# EAGLE schematic circuit (EAGLE 7.5.0)
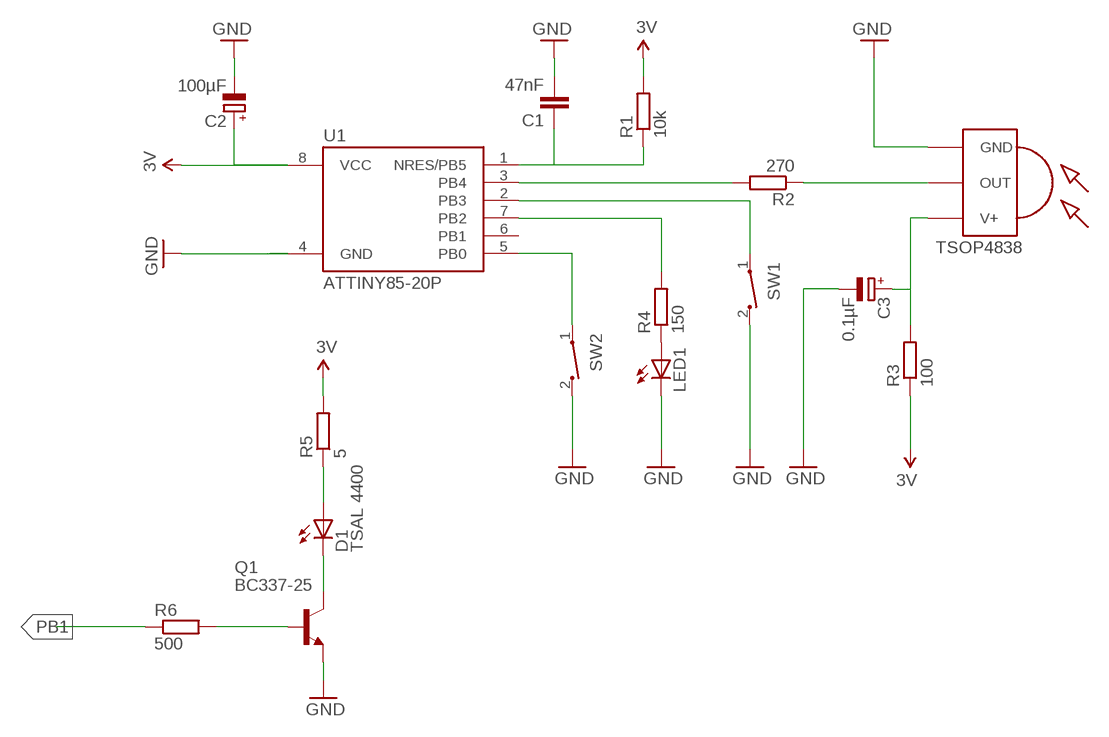
[diagram p0: schematic, sheet 1]

## Parts
C1  47nF  C-EU025-025X050  [C025-025X050]
C2  100µF  CPOL-EU085CS-1AR  [085CS_1AR]
C3  0.1µF  CPOL-EU085CS-1AR  [085CS_1AR]
D1  TSAL 4400  SFH482  [SFH482]
LED1  LED5MM  [LED5MM]
Q1  BC337-25  BC337  [TO92]
R1  10k  R-EU_0204/2V  [0204V]
R2  270  R-EU_0204/2V  [0204V]
R3  100  R-EU_0204/2V  [0204V]
R4  150  R-EU_0204/2V  [0204V]
R5  5  R-EU_0204/2V  [0204V]
R6  500  R-EU_0204/2V  [0204V]
SW1  CT10-XXXX-A2  [CT10-XXXX-A2]
SW2  CT10-XXXX-A2  [CT10-XXXX-A2]
U1  ATTINY85-20P  [PDIP08_300MIL]
U$1  TSOP4838  [TSOP18XX]

## Nets
3.3V: C2.+ R1.2 R3.1 R5.2 U1.8(VCC) ; supply symbol labelled 3V
GND: C1.2 C2.- C3.- LED1.K(C) Q1.1(E) SW1.2 SW2.2 U1.4(GND) U$1.GND
N$1: R1.1 U1.1(NRES/PB5)
N$2: C1.1
N$3: R2.2 U1.3(PB4)
N$4: R2.1 U$1.OUT
N$5: C3.+ R3.2 U$1.VCC(V+)
N$6: SW1.1 U1.2(PB3)
N$7: SW2.1 U1.5(PB0)
N$8: D1.A R5.1
N$9: LED1.A R4.1
N$10: R4.2 U1.7(PB2)
N$11: D1.K(C) Q1.3(C)
N$12: Q1.2(B) R6.2
PB1: R6.1
Unconnected: U1.6(PB1)

## Library data of the parts
C1 = rcl:C-EU: CAPACITOR, European symbol
C2 C3 = rcl:CPOL-EU: POLARIZED CAPACITOR, European symbol
D1 = led:SFH482: IR LED infrared emitting diode, Infineon
LED1 = led:LED: LED OSRAM: - CHIPLED LG R971, LG N971, LY N971, LG Q971, LY Q971, LO R971, LY R971 LH N974, LH R974 LS Q976, LO Q976, LY Q976 LO Q996 - Hyper CHIPLED LW Q18S LB Q993, LB Q99A, LB R99A - SideLED LS A670, LO A670, LY A670, LG A670, LP A670 LB A673, LV A673, LT A673, LW A673 LH A674 LY A675 LS A676, LA A676, LO A676, LY A676, LW A676 LS A679, LY A679, LG A679 - Hyper Micro SIDELED® LS Y876, LA Y876, LO Y876, LY Y876 LT Y87S - SmartLED LW L88C, LW L88S LB L89C, LB L89S, LG L890 LS L89K, LO L89K, LY L89K LS L896, LA L896, LO L896, LY L896 - TOPLED LS T670, LO T670, LY T670, LG T670, LP T670 LSG T670, LSP T670, LSY T670, LOP T670, LYG T670 LG T671, LOG T671, LSG T671 LB T673, LV T673, LT T673, LW T673 LH T674 LS T676, LA T676, LO T676, LY T676, LB T676, LH T676, LSB T676, LW T676 LB T67C, LV T67C, LT T67C, LS T67K, LO T67K, LY T67K, LW E67C LS E67B, LA E67B, LO E67B, LY E67B, LB E67C, LV E67C, LT E67C LW T67C LS T679, LY T679, LG T679 LS T770, LO T770, LY T770, LG T770, LP T770 LB T773, LV T773, LT T773, LW T773 LH T774 LS E675, LA E675, LY E675, LS T675 LS T776, LA T776, LO T776, LY T776, LB T776 LHGB T686 LT T68C, LB T68C - Hyper Mini TOPLED® LB M676 - Mini TOPLED Santana® LG M470 LS M47K, LO M47K, LY M47K Source: http://www.osram.convergy.de LUXEON: - LUMILED® LXK2-PW12-R00, LXK2-PW12-S00, LXK2-PW14-U00, LXK2-PW14-V00 LXK2-PM12-R00, LXK2-PM12-S00, LXK2-PM14-U00 LXK2-PE12-Q00, LXK2-PE12-R00, LXK2-PE12-S00, LXK2-PE14-T00, LXK2-PE14-U00 LXK2-PB12-K00, LXK2-PB12-L00, LXK2-PB12-M00, LXK2-PB14-N00, LXK2-PB14-P00, LXK2-PB14-Q00 LXK2-PR12-L00, LXK2-PR12-M00, LXK2-PR14-Q00, LXK2-PR14-R00 LXK2-PD12-Q00, LXK2-PD12-R00, LXK2-PD12-S00 LXK2-PH12-R00, LXK2-PH12-S00 LXK2-PL12-P00, LXK2-PL12-Q00, LXK2-PL12-R00 Source: www.luxeon.com KINGBRIGHT: KA-3528ASYC Source: www.kingbright.com
Q1 = transistor-npn:BC337*: NPN Transistor
R1-R6 = rcl:R-EU_: RESISTOR, European symbol
SW1 SW2 = switch-coto:CT10-XXXX-: CT10 Series Molded Switch Source: www.cotorelay.com .. Coto_Technology__CT10-1530-G1.pdf
U1 = _hhn_attiny25_45_85:ATTINY85*: ATMEL ATtiny 85 Packages: P = PDIP 08 30mil S = SOIC 08 EIAJ 208mil Technologies Note: for complete ordering code (temp. range, finish, tape&reel etc.) see www.atmel.com • Supply Voltage: V = (1.8…5.5)V | [blank] = (2.7…5.5)V • Speed: 10 = 10 MHz | 20 = 20 MHz Author: Dipl.-Ing. FH Rainer Bayer HHN Hochschule Heilbronn (Heilbronn University), rainer.bayer@hs-heilbronn.de Ingenieurbüro ing-rb, mail@ing-rb.de
U$1 = tsop-1:TSOP4838: IR Receiver and Demodulator